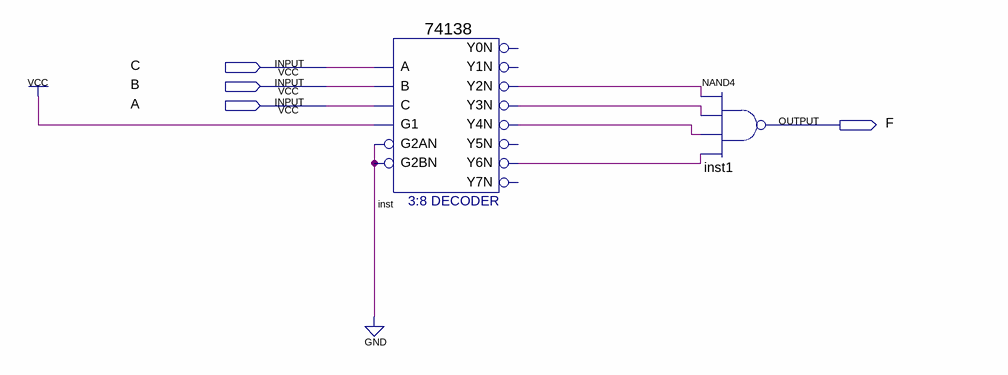
[diagram p0: schematic sheet]
// Quartus schematic USE74138.bdf as structural Verilog: 2 symbols, 4 pins
module USE74138 (
  input  C,
  input  B,
  input  A,
  output F
);

  wire inst_y2n, inst_y3n, inst_y4n, inst_y6n;

  \74138  inst (
    .A(C), .B(B), .G1(1'b1), .C(A), .G2AN(1'b0), .G2BN(1'b0), .Y2N(inst_y2n), .Y3N(inst_y3n), .Y4N(inst_y4n),
    .Y6N(inst_y6n));  // open: Y0N, Y1N, Y5N, Y7N
  nand inst1 (F, inst_y2n, inst_y3n, inst_y4n, inst_y6n);
endmodule
